# EAGLE design 4809-dip-th (EAGLE 7.7.0)
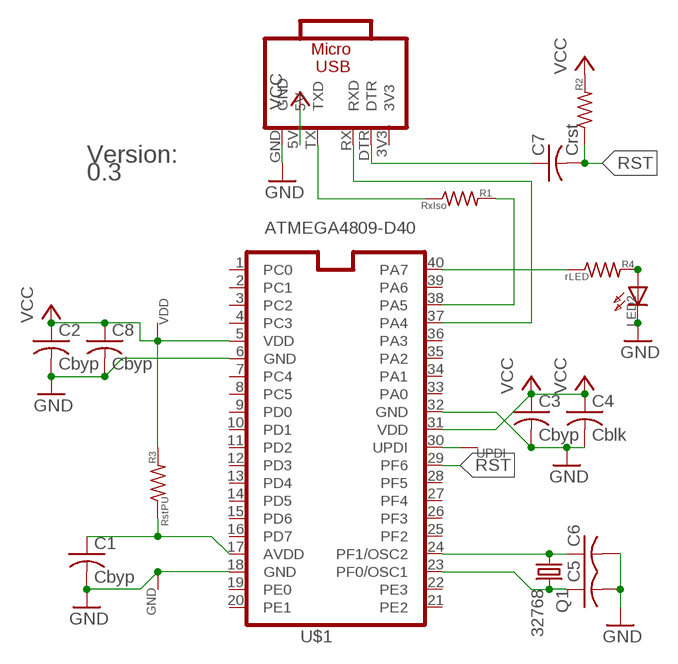
[diagram p0: schematic, sheet 1]

## Parts
C1  Cbyp  C-US-2.5MM  [C025-025X050]
C2  Cbyp  C-US-2.5MM  [C025-025X050]
C3  Cbyp  C-US-2.5MM  [C025-025X050]
C4  Cblk  C-US-2.5MM  [C025-025X050]
C5  C-US-2.5MM  [C025-025X050]
C6  C-US-2.5MM  [C025-025X050]
C7  Crst  C-US-2.5MM  [C025-025X050]
C8  Cbyp  C-USC1206  [C1206]
GND  WIRE-R10  [VIA10]
LED2  LED3MM  [LED3-2S]
MOD1  CH340E-MODNOHOLES  [CH340E-MOD-NOHOLES]
Q1  32768  CRYSTALTC26HL  [TC26HL]
R1  RxIso  R-US_0204/7  [0204/7]
R2  R-US_0204/7  [0204/7]
R3  RstPU  R-US_R0805  [R0805]
R4  rLED  R-US_0204/7  [0204/7]
U$1  ATMEGA4809-D40  [DIL40SOC]
UPDI  WIRE-R10  [VIA10]
VDD  WIRE-VIA8  [VIA8]
VS1  0.3  VERSIONSTRING  [VERSIONSTRING]

## Nets
GND [power]: C1.2 C2.2 C3.2 C4.2 C5.2 C6.2 C8.2 GND.P$1 LED2.P$2(C) MOD1.GND U$1.6(GND) U$1.18(GND) U$1.32(GND)
N$1: LED2.P$1(A) R4.2
N$2: R4.1 U$1.40(PA7)
N$3: R1.2 U$1.38(PA5)
N$4: MOD1.RX(RXD) U$1.37(PA4)
N$5: C1.1 R3.1 U$1.17(AVDD)
N$6: C6.1 Q1.1 U$1.24(PF1/OSC2)
N$7: C5.1 Q1.2 U$1.23(PF0/OSC1)
N$8: C7.1 MOD1.DTR
RST: C7.2 R2.1 U$1.29(PF6)
UPDI: U$1.30(UPDI) UPDI.P$1
USBTX: MOD1.TX(TXD) R1.1
VCC [power]: C2.1 C3.1 C4.1 C8.1 MOD1.5V R2.2 R3.2 U$1.5(VDD) U$1.31(VDD) VDD.P$1
Unconnected: U$1.1(PC0) U$1.2(PC1) U$1.3(PC2) U$1.4(PC3) U$1.7(PC4) U$1.8(PC5) U$1.9(PD0) U$1.10(PD1) U$1.11(PD2) U$1.12(PD3) U$1.13(PD4) U$1.14(PD5) U$1.15(PD6) U$1.16(PD7) U$1.19(PE0) U$1.20(PE1) U$1.21(PE2) U$1.22(PE3) U$1.25(PF2) U$1.26(PF3) U$1.27(PF4) U$1.28(PF5) U$1.33(PA0) U$1.34(PA1) U$1.35(PA2) U$1.36(PA3) U$1.39(PA6)

## Power pins joined to a net without a drawn wire
3V3: MOD1.3V3

## Library data of the parts
C1-C8 = my-rcl:C-US: CAPACITOR, American symbol
GND UPDI VDD = mylib4:WIRE: Pad for a wire offboard
LED2 = mylib4:LED: LED, edge-mounted
MOD1 = mini-usb:CH340E-MOD
Q1 = mylib4:CRYSTAL: CRYSTAL
R1-R4 = my-rcl:R-US_: RESISTOR, American symbol
U$1 = avr:ATMEGA4809-D40
VS1 = mylib4:VERSIONSTRING

## Net classes
0 default: width 0.5 mm, clearance 0.01 mm
1 power: width 1 mm, clearance 0.015 mm

## Board
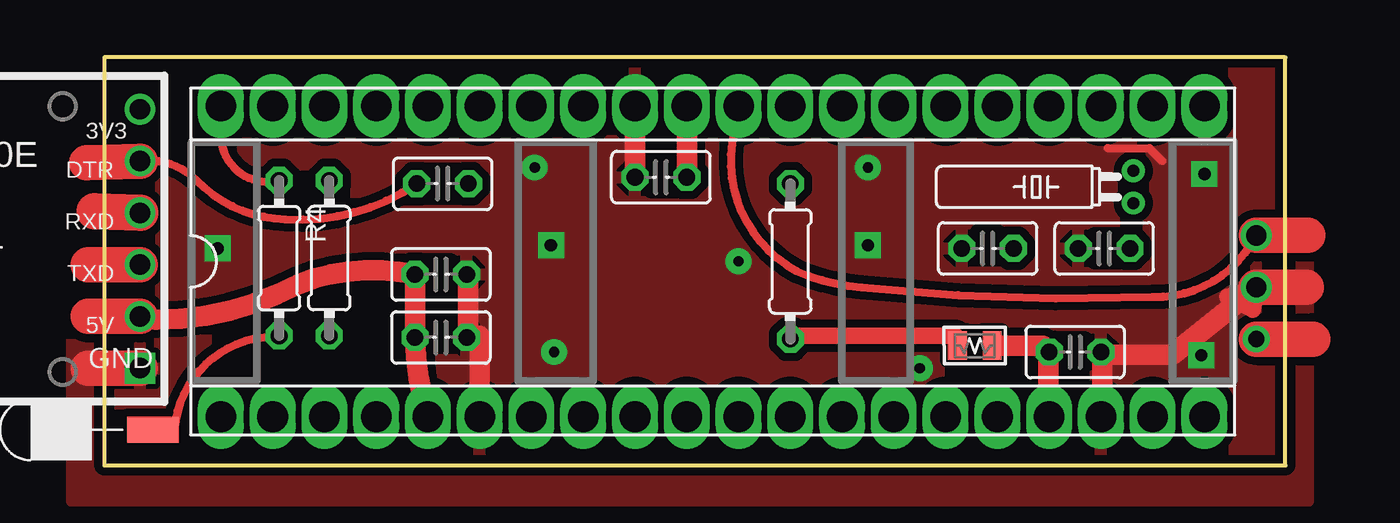
[diagram p1: board, top side]
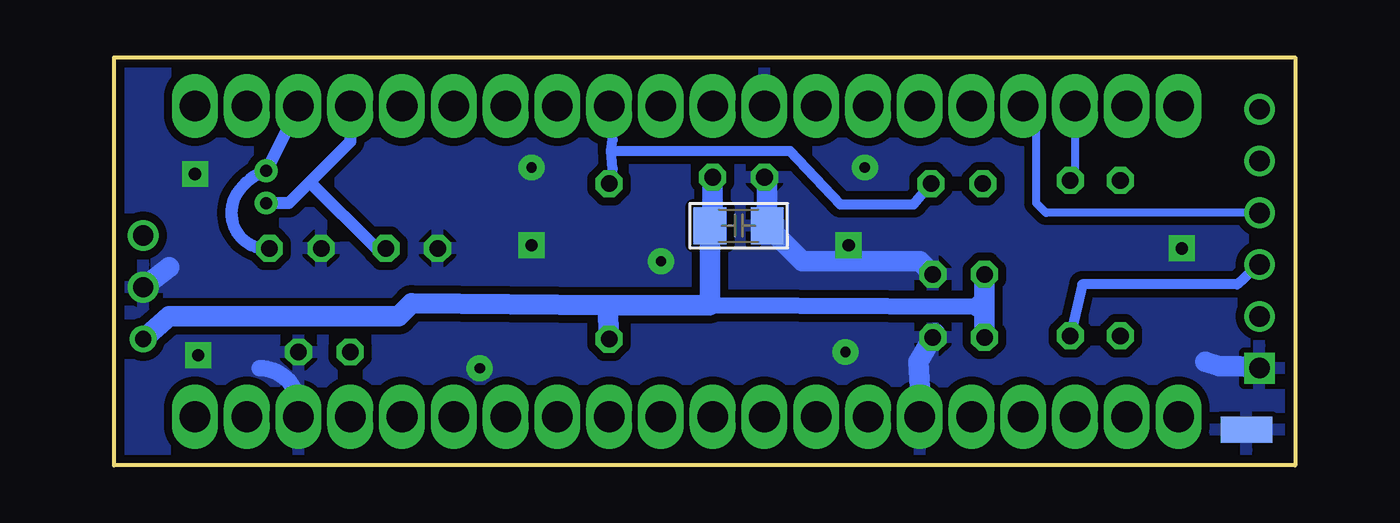
[diagram p2: board, bottom side, seen from below]

Size 57.94 x 20 mm. Coordinates in mm from the lower left corner, seen from the top.
Outline: 0,0 57.94,0 57.94,20 0,20 0,0
Copper layers (1*16): Top 0.035mm / dielectric 1.5mm / Bottom 0.035mm
Design rules "default *": minimum track width 10mil, minimum drill 0.5mm, track to track 8mil, track to pad 8mil, pad to pad 8mil, via to via 8mil, smd to smd 8mil, copper to edge 16mil, drill to drill 8mil, minimum pad ring 10mil, minimum via ring 8mil, stop-mask expansion 0mil, vias tented up to drill 0.55mm, thermal gap 10mil
tRestrict: area 16.1,13.2 to 17.1,14.4; area 16,8.7 to 17,10; area 16,5.9 to 17,7.1; area 26.8,13.5 to 27.8,14.8; area 47.1,4.9 to 48.1,6.2; area 42.9,10.2 to 43.8,11.4; area 48.6,10 to 49.5,11.3; area 26.8,14.9 to 27.8,16.2; area 16,7.3 to 17,8.6; 1 lines

### Footprints (pad centres in the part's own frame; a part is rotated, then mirrored left to right if it is on the bottom)
C025-025X050 = drill 0.813 octagon: 1 -1.27,0; 2 1.27,0
C1206 = smd 1.6 x 1.8: 1 -1.4,0; 2 1.4,0
VIA10 = drill 1: P$1 0,0
LED3-2S = smd 2.54 x 1.27: P$1 0,0 | smd 2.54 x 1.27 bottom: P$2 0,0
CH340E-MOD-NOHOLES = drill 1: 3V3 6.35,6.35; 5V 6.35,-3.81; DTR 6.35,3.81; RX 6.35,1.27; TX 6.35,-1.27 | drill 1 square: GND 6.35,-6.35
TC26HL = drill 0.6: 1 -0.794,0; 2 0.794,0
0204/7 = drill 0.813 octagon: 1 -3.81,0; 2 3.81,0
R0805 = smd 0.914 x 1.397: 1 -0.85,0; 2 0.85,0
DIL40SOC = drill 1.5 long: 1 -22.86,-7.62; 2 -20.32,-7.62; 3 -17.78,-7.62; 4 -15.24,-7.62; 5 -12.7,-7.62; 6 -10.16,-7.62; 7 -7.62,-7.62; 8 -5.08,-7.62; 9 -2.54,-7.62; 10 0,-7.62; 11 2.54,-7.62; 12 5.08,-7.62; 13 7.62,-7.62; 14 10.16,-7.62; 15 12.7,-7.62; 16 15.24,-7.62; 17 17.78,-7.62; 18 20.32,-7.62; 19 22.86,-7.62; 20 25.4,-7.62; 21 25.4,7.62; 22 22.86,7.62; 23 20.32,7.62; 24 17.78,7.62; 25 15.24,7.62; 26 12.7,7.62; 27 10.16,7.62; 28 7.62,7.62; 29 5.08,7.62; 30 2.54,7.62; 31 0,7.62; 32 -2.54,7.62; 33 -5.08,7.62; 34 -7.62,7.62; 35 -10.16,7.62; 36 -12.7,7.62; 37 -15.24,7.62; 38 -17.78,7.62; 39 -20.32,7.62; 40 -22.86,7.62
VIA8 = drill 0.8: P$1 0,0

### Placement (x,y rotation side)
C1  47.62,5.56 0 top
C2  16.51,6.27 0 top
C3  27.31,14.13 180 top
C4  16.51,9.37 0 top
C5  49.05,10.64 180 top
C6  43.34,10.64 180 top
C7  16.59,13.81 0 top
C8  27.31,11.75 0 bottom
GND  56.52,8.73 0 top
LED2  2.38,1.75 180 top
MOD1  -4.6,11.11 0 top
Q1  50.48,13.65 90 top
R1  11.03,10.16 90 top
R2  33.66,10 270 top
R3  42.7,5.87 180 top
R4  8.57,10.16 270 top
U$1  28.57,10 0 top
UPDI  56.52,11.27 0 top
VDD  56.52,6.19 0 top
VS1  23.34,6.83 180 top

### Tracks (layer width: path | path; a pad name or v marks a point on that pad's centre or on a via)
GND  (via drill 0.5 pad 1.27, 0.6 pad 1.27)
  Top 0.4: 49.21,15.56 51.28,15.56 51.91,14.92
  Top 0.8: GND.P$1 55.09,8.26 56.36,7.62 GND.P$1
  Top 1: C1.2 48.95,5.42 48.95,2.43 U$1.18 | C1.2 49.48,5.42 52.39,5.42 GND.P$1 | C2.2 17.84,6.65 17.84,9.29 C4.2 | 48.74,5.59 C1.2 | U$1.6 18.42,6.35 17.78,6.35 | C3.2 26.04,17.46
  Top 1.75: MOD1.GND -0.79,4.76 | GND.P$1 58.98,8.73
  Bottom 0.8: U$1.18 48.89,2.86 arc-90 50.8,4.76
  Bottom 1: 55.24,9.71 GND.P$1 | C3.2 25.92,14.03 25.92,11.92 C8.2 24.16,10 18.42,10 17.84,9.42 17.84,9.29 | 4.4,5.07 3.71,4.85 2.73,4.85 MOD1.GND | C2.2 17.66,6.47 18.48,5.07 18.36,2.96 18.36,2.43 U$1.6
  other vias: 5.56,10.64 21.11,14.6 21.91,10.8 37.47,14.6 40,4.76 22.07,5.56 53.97,14.29 53.82,5.4 31.11,10 37.47,10.8
  pour Bottom (isolate 0.4): -1.9,23.02 59.37,23.02 59.37,-2.38 -1.9,-2.38
  pour Top (isolate 0.4): -1.59,21.11 59.05,21.11 59.05,-1.75 -1.59,-1.75
N$1
  Top 0.4: R4.2 7.3,6.19 arc67 3.49,2.22 arc-138 LED2.P$1
N$2
  Top 0.4: U$1.40 5.71,16.19 arc104 R4.1
N$3
  Bottom 0.4: U$1.38 10.79,14.21 R1.2
N$4
  Top 1.8: MOD1.RX -0.48,12.46
  Bottom 0.4: MOD1.RX 12.22,12.38 12.7,12.86 12.7,16.99 U$1.37
N$5
  Top 0.5: 46.32,5.42 C1.1 | 46.32,2.43 U$1.17
  Top 1: 46.32,2.43 46.32,5.42 | R3.1 46.04,5.87 C1.1
  Bottom 0.5: 46.25,5.66 46.32,5.59 C1.1
N$6
  Bottom 0.6: U$1.24 46.36,15.88 48.34,13.89 | 48.34,13.89 49.37,12.86 Q1.1 | C6.1 45.08,10.64 48.34,13.89
N$7
  Bottom 0.6: C5.1 arc127 51.91,13.34 arc38 Q1.2 U$1.23
N$8
  Top 0.4: MOD1.DTR arc-54 4.52,13.97 arc44 8.89,12.07 arc37 C7.1
  Top 1.75: MOD1.DTR -0.87,14.84
RST
  Bottom 0.5: 33.57,15.42 24.78,15.42 22.32,12.8 18.71,12.8 C7.2 | 33.57,15.42 33.48,14.56 R2.1 | 33.57,15.42 33.48,15.97 33.48,17.55 U$1.29
UPDI
  Top 0.4: U$1.30 31.27,17.46 arc86 33.97,9.53 arc20 37.15,8.73 arc8 51.44,8.26 arc64 UPDI.P$1
  Top 1.75: UPDI.P$1 59.05,11.27
USBTX
  Top 1.75: MOD1.TX -0.79,9.84
  Bottom 0.5: R1.1 10.45,8.87 2.84,8.87 1.78,9.85 MOD1.TX
VCC
  Top 0.8: R2.2 33.97,6.35 41.75,6.35 41.85,6.09 R3.2
  Top 1: MOD1.5V 2.54,7.14 arc29 9.53,8.89 arc-33 C4.1 C2.1 arc17 U$1.5 | U$1.31 C3.1
  Top 1.75: MOD1.5V -0.79,7.3 | VDD.P$1 59.29,6.19
  Bottom 0.8: 28.73,7.86 15.56,7.78
  Bottom 1: VDD.P$1 55.24,7.3 43.97,7.3 43.34,7.94 33.73,7.86 | C4.1 15.24,8.1 | 15.24,8.1 C2.1 | 33.73,7.86 28.73,7.86 28.71,8.28 C8.1 28.57,11.88 C3.1 | 15.56,7.78 15.24,8.1 | R2.2 33.73,7.86

### Text on the board
History: 20190830 by WestfW: RX/TX reversed, damn it. Fix.
_tSilk: 3V3 | UPDI | DTR | R | 32768 | Crst | Cbyp | T | 5 | rLED | rRX | Cblk | RSTPU | FB | Cbyp | Cbyp | VDD | Gnd
_bplace: ATmega4809 | Copyright 2019 by William Westfield | Ver